# Altium schematic sheet PMODs_User_IO.SchDoc
size A
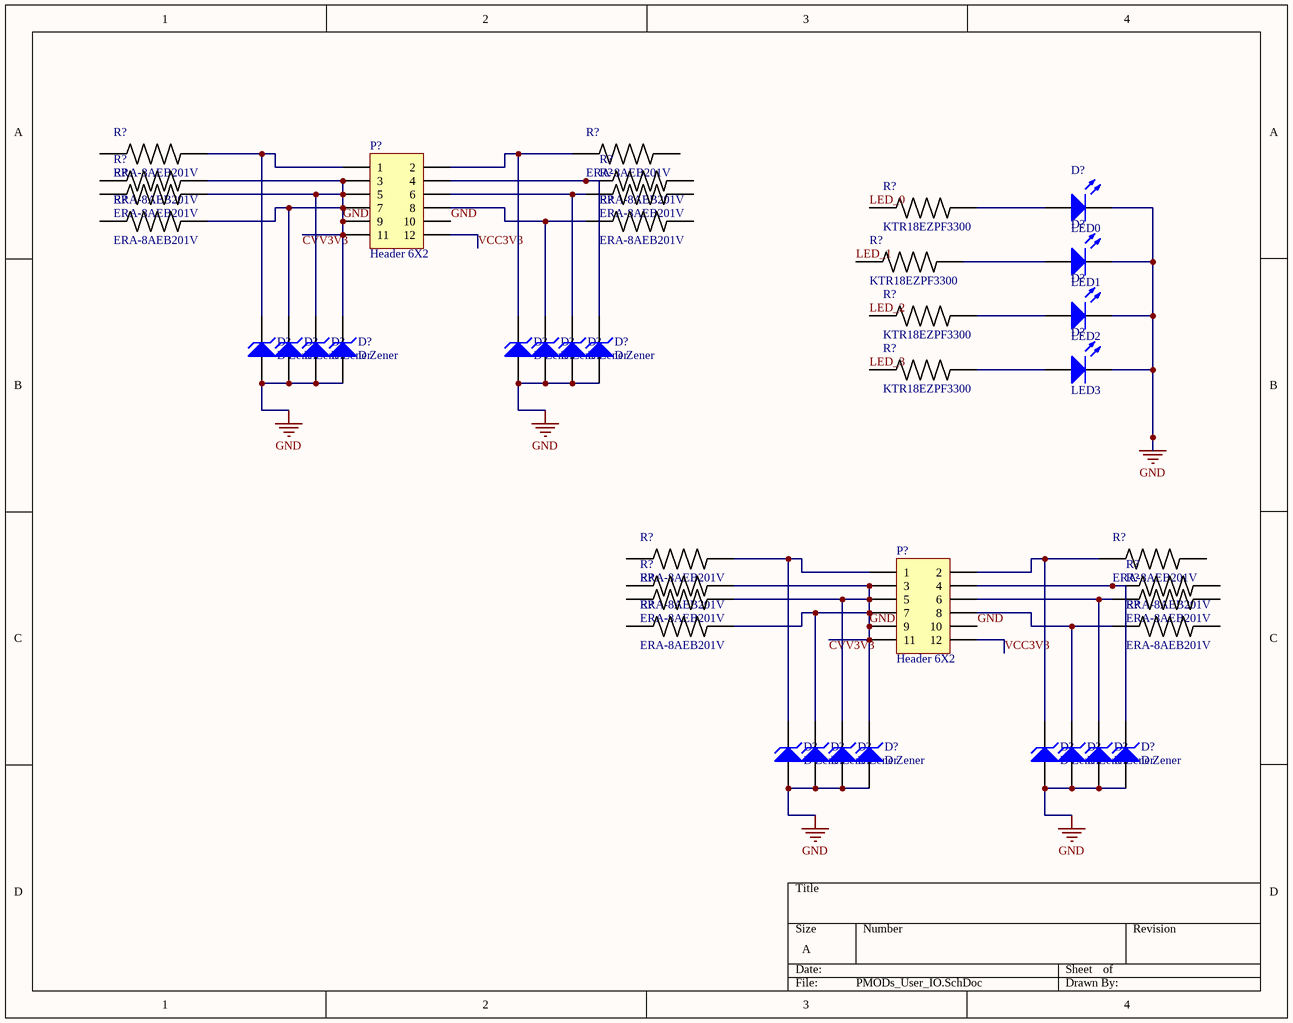
[diagram p0: PMODs_User_IO.SchDoc]

## Parts
(Parts that share a designator on the sheet are numbered #1, #2 ... from top to bottom, then left to right.)
D?#1  LED0  [LED-0]
D?#2  LED1  [LED-1]
D?#3  LED2  [3.2X1.6X1.1]
D?#4  D Zener  [DIODE-0.7]
D?#5  D Zener  [DIODE-0.7]
D?#6  D Zener  [DIODE-0.7]
D?#7  D Zener  [DIODE-0.7]
D?#8  D Zener  [DIODE-0.7]
D?#9  D Zener  [DIODE-0.7]
D?#10  D Zener  [DIODE-0.7]
D?#11  D Zener  [DIODE-0.7]
D?#12  LED3  [3.5X2.8X1.9]
D?#13  D Zener  [DIODE-0.7]
D?#14  D Zener  [DIODE-0.7]
D?#15  D Zener  [DIODE-0.7]
D?#16  D Zener  [DIODE-0.7]
D?#17  D Zener  [DIODE-0.7]
D?#18  D Zener  [DIODE-0.7]
D?#19  D Zener  [DIODE-0.7]
D?#20  D Zener  [DIODE-0.7]
P?#1  Header 6X2  [HDR2X6]
P?#2  Header 6X2  [HDR2X6]
R?#1  ERA-8AEB201V  [*RESC3216X70N]
R?#2  ERA-8AEB201V  [*RESC3216X70N]
R?#3  ERA-8AEB201V  [*RESC3216X70N]
R?#4  ERA-8AEB201V  [*RESC3216X70N]
R?#5  ERA-8AEB201V  [*RESC3216X70N]
R?#6  ERA-8AEB201V  [*RESC3216X70N]
R?#7  KTR18EZPF3300  [*RESC3216X65N]
R?#8  ERA-8AEB201V  [*RESC3216X70N]
R?#9  ERA-8AEB201V  [*RESC3216X70N]
R?#10  KTR18EZPF3300  [*RESC3216X65N]
R?#11  KTR18EZPF3300  [*RESC3216X65N]
R?#12  KTR18EZPF3300  [*RESC3216X65N]
R?#13  ERA-8AEB201V  [*RESC3216X70N]
R?#14  ERA-8AEB201V  [*RESC3216X70N]
R?#15  ERA-8AEB201V  [*RESC3216X70N]
R?#16  ERA-8AEB201V  [*RESC3216X70N]
R?#17  ERA-8AEB201V  [*RESC3216X70N]
R?#18  ERA-8AEB201V  [*RESC3216X70N]
R?#19  ERA-8AEB201V  [*RESC3216X70N]
R?#20  ERA-8AEB201V  [*RESC3216X70N]

## Nets
GND: D?#1.2(K) D?#2.2(K) D?#3.2(K) D?#4.1(A) D?#5.1(A) D?#5.2(K) D?#6.1(A) D?#6.2(K) D?#7.1(A) D?#7.2(K) D?#8.1(A) D?#9.1(A) D?#10.1(A) D?#11.1(A) D?#12.2(K) D?#13.1(A) D?#14.1(A) D?#14.2(K) D?#15.1(A) D?#15.2(K) D?#16.1(A) D?#16.2(K) D?#17.1(A) D?#18.1(A) D?#19.1(A) D?#20.1(A) P?#1.3 P?#1.5 P?#1.7 P?#1.9 P?#1.10 P?#1.11 P?#2.3 P?#2.5 P?#2.7 P?#2.9 P?#2.10 P?#2.11 R?#3.2 R?#5.2 R?#8.2 R?#15.2 R?#17.2 R?#19.2
LED_0: R?#7.1
LED_1: R?#10.1
LED_2: R?#11.1
LED_3: R?#12.1
VCC3V3: P?#1.12 P?#2.12
NetD?#1_1: D?#1.1(A) R?#7.2
NetD?#2_1: D?#2.1(A) R?#10.2
NetD?#3_1: D?#3.1(A) R?#11.2
NetD?#4_2: D?#4.2(K) P?#1.1 R?#1.2
NetD?#8_2: D?#8.2(K) P?#1.2 R?#2.1
NetD?#9_2: D?#9.2(K) P?#1.8 R?#9.1
NetD?#10_2: D?#10.2(K) P?#1.6 R?#6.1
NetD?#11_2: D?#11.2(K) P?#1.4 R?#4.1
NetD?#12_1: D?#12.1(A) R?#12.2
NetD?#13_2: D?#13.2(K) P?#2.1 R?#13.2
NetD?#17_2: D?#17.2(K) P?#2.2 R?#14.1
NetD?#18_2: D?#18.2(K) P?#2.8 R?#20.1
NetD?#19_2: D?#19.2(K) P?#2.6 R?#18.1
NetD?#20_2: D?#20.2(K) P?#2.4 R?#16.1

Not connected (* = marked no-connect by the designer): R?#1 1; R?#2 2; R?#3 1; R?#4 2; R?#5 1; R?#6 2; R?#8 1; R?#9 2; R?#13 1; R?#14 2; R?#15 1; R?#16 2; R?#17 1; R?#18 2; R?#19 1; R?#20 2

## Notes on the sheet
- Labels drawn without touching a wire or pin: CVV3V3

## Library data of the parts
D?#1 = LED0: Typical INFRARED GaAs LED; Published: 8-Jun-2000; LatestRevisionDate: 08-Jul-2005; LatestRevisionNote: Mech Layer 1 removed.; PackageReference: LED-0; Publisher: Altium Limited; PackageDescription: LED; 2 Leads
D?#2 = LED1: Typical RED GaAs LED; Published: 8-Jun-2000; LatestRevisionDate: 08-Jul-2005; LatestRevisionNote: Mech Layer 1 removed.; PackageReference: LED-1; Publisher: Altium Limited; PackageDescription: LED; 2 Leads
D?#3 = LED2: Typical RED, GREEN, YELLOW, AMBER GaAs LED; Published: 8-Jun-2000; LatestRevisionDate: 17-Jul-2002; LatestRevisionNote: Re-released for DXP Platform.; PackageVersion: Feb-2002; PackageReference: 3.2X1.6X1.1; Publisher: Altium Limited; PackageDescription: SM LED; 2 Flat Leads
D?#4-D?#11 D?#13-D?#20 = D Zener: Zener Diode; Published: 8-Jun-2000; LatestRevisionDate: 17-Jul-2002; LatestRevisionNote: Re-released for DXP Platform.; PackageReference: DIODE-0.7; Publisher: Altium Limited; PackageDescription: Diode, Thru-Hole; 2 Leads; 0.7 in Pin Spacing
D?#12 = LED3: Typical BLUE SiC LED; Published: 8-Jun-2000; LatestRevisionDate: 17-Dec-2003; LatestRevisionNote: PCB Footprint replaced.; DatasheetVersion: 16-Apr-2002; PackageVersion: 16-Apr-2002; PackageReference: 3.5X2.8X1.9; Publisher: Altium Limited; PackageDescription: SM LED; 2 C-Bend Leads; Body 3.5 x 2.8 x 1.9 mm, inc leads (LxWxH typ)
P?#1 P?#2 = Header 6X2: Header, 6-Pin, Dual row; LatestRevisionDate: 17-Jul-2002; LatestRevisionNote: Re-released for DXP Platform.; Publisher: Altium Limited
R?#1-R?#6 R?#8 R?#9 R?#13-R?#20 = ERA-8AEB201V: / Res Thin Film 1206 200 Ohm 0.1% 0.25W_1/4W_ Â±25ppm/C Pad SMD Automotive T/R /; MF: Panasonic; SnapEDA_Link: https://www.snapeda.com/parts/ERA-8AEB201V/Panasonic%20Electronic%20Components/view-part/?ref=snap; Availability: Unavailable; Price: None; MP: ERA-8AEB201V; Package: 3216 Panasonic Electronic Components; Value: *
R?#7 R?#10-R?#12 = KTR18EZPF3300: MF: Rohm; SnapEDA_Link: https://www.snapeda.com/parts/KTR18EZPF3300/Rohm/view-part/?ref=snap; Availability: Unavailable; Price: None; MP: KTR18EZPF3300; Package: 3216 Rohm Semiconductor; Value: *